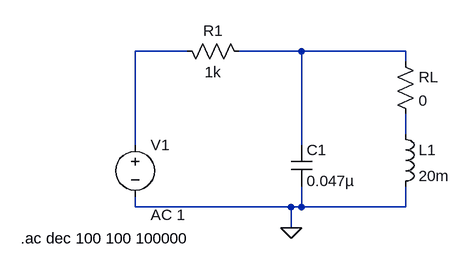
[diagram p0: schematic bpf_ltspice.asc]
bpf_ltspice.asc, the LTspice schematic file:
Version 4
SHEET 1 880 680
WIRE 80 32 0 32
WIRE 256 32 160 32
WIRE 416 32 256 32
WIRE 416 48 416 32
WIRE 416 160 416 128
WIRE 0 176 0 32
WIRE 256 176 256 32
WIRE 0 272 0 256
WIRE 240 272 0 272
WIRE 256 272 256 240
WIRE 256 272 240 272
WIRE 416 272 416 240
WIRE 416 272 256 272
WIRE 240 304 240 272
FLAG 240 304 0
SYMBOL res 64 16 M90
WINDOW 0 0 56 VBottom 2
WINDOW 3 32 56 VTop 2
SYMATTR InstName R1
SYMATTR Value 1k
SYMBOL cap 240 176 R0
SYMATTR InstName C1
SYMATTR Value 0.047µ
SYMBOL voltage 0 160 R0
WINDOW 123 24 124 Left 2
WINDOW 39 0 0 Left 0
SYMATTR Value2 AC 1
SYMATTR InstName V1
SYMATTR Value ""
SYMBOL ind 400 144 R0
SYMATTR InstName L1
SYMATTR Value 20m
SYMBOL res 400 32 R0
SYMATTR InstName RL
SYMATTR Value 0
TEXT -176 320 Left 2 !.ac dec 100 100 100000

The netlist it stands for:
* bpf_ltspice.asc
R1 N001 N002 1k
C1 N002 0 0.047µ
V1 N001 0 AC 1
L1 N003 0 20m
RL N002 N003 0
.ac dec 100 100 100000
.backanno
.end